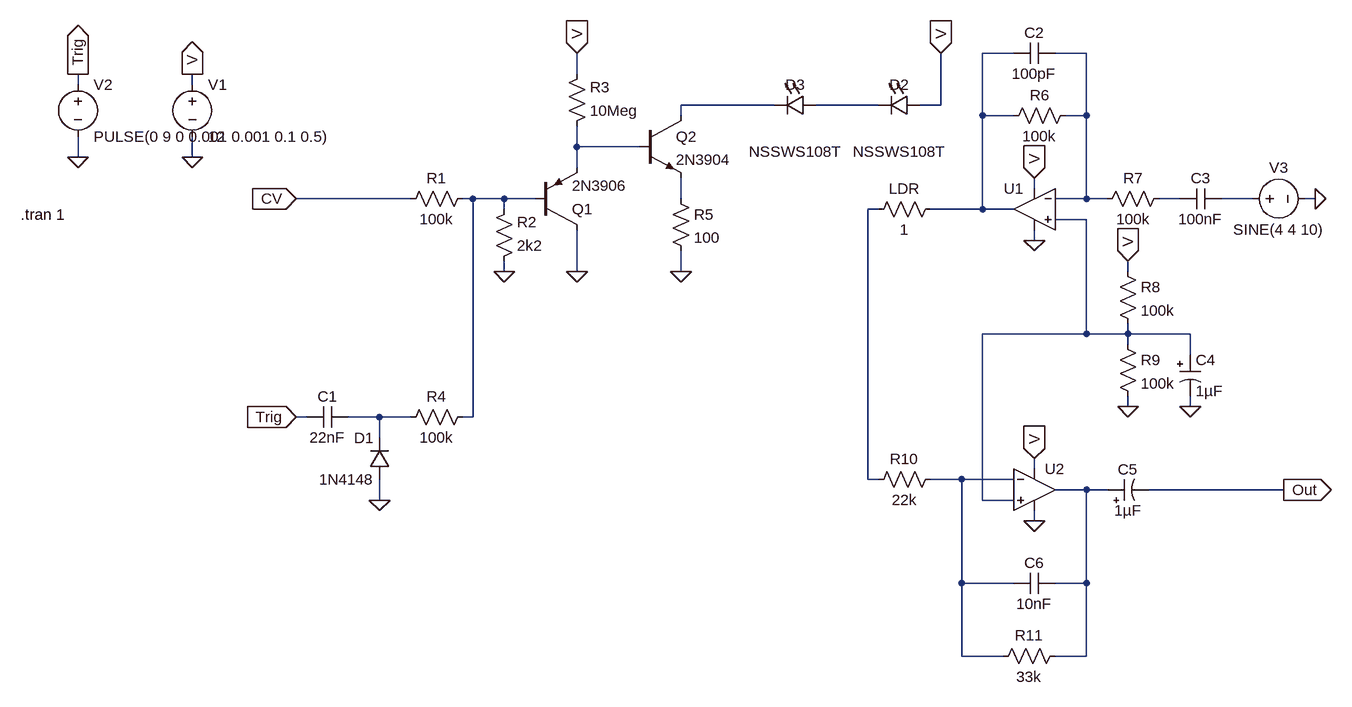
[diagram p0: schematic LPG_VCA.asc]
LPG_VCA.asc, the LTspice schematic file:
Version 4
SHEET 1 1352 824
WIRE 800 -144 752 -144
WIRE 912 -144 864 -144
WIRE 128 -112 128 -144
WIRE -640 -96 -640 -112
WIRE -464 -96 -464 -112
WIRE 432 -64 288 -64
WIRE 592 -64 496 -64
WIRE 688 -64 688 -144
WIRE 688 -64 656 -64
WIRE 288 -48 288 -64
WIRE 752 -48 752 -144
WIRE 800 -48 752 -48
WIRE 912 -48 912 -144
WIRE 912 -48 880 -48
WIRE 128 0 128 -32
WIRE 224 0 128 0
WIRE -640 16 -640 -16
WIRE -464 16 -464 -16
WIRE 128 32 128 0
WIRE 832 64 832 48
WIRE -128 80 -304 80
WIRE -32 80 -48 80
WIRE 16 80 -32 80
WIRE 64 80 16 80
WIRE 288 80 288 48
WIRE 912 80 912 -48
WIRE 912 80 864 80
WIRE 944 80 912 80
WIRE 1056 80 1024 80
WIRE 1168 80 1120 80
WIRE 1264 80 1248 80
WIRE 16 96 16 80
WIRE 592 96 576 96
WIRE 752 96 752 -48
WIRE 752 96 672 96
WIRE 800 96 752 96
WIRE 912 112 864 112
WIRE 832 144 832 128
WIRE 16 192 16 176
WIRE 128 192 128 128
WIRE 288 192 288 160
WIRE 976 192 976 176
WIRE 912 288 912 112
WIRE 912 288 752 288
WIRE 976 288 976 272
WIRE 976 288 912 288
WIRE 1072 288 976 288
WIRE 976 304 976 288
WIRE 1072 320 1072 288
WIRE 976 400 976 384
WIRE 1072 400 1072 384
WIRE -288 416 -304 416
WIRE -176 416 -224 416
WIRE -128 416 -176 416
WIRE -32 416 -32 80
WIRE -32 416 -48 416
WIRE -176 448 -176 416
WIRE 832 496 832 480
WIRE 576 512 576 96
WIRE 592 512 576 512
WIRE 720 512 672 512
WIRE 800 512 720 512
WIRE 912 528 864 528
WIRE 944 528 912 528
WIRE 1216 528 1008 528
WIRE -176 544 -176 512
WIRE 752 544 752 288
WIRE 800 544 752 544
WIRE 832 576 832 560
WIRE 720 672 720 512
WIRE 800 672 720 672
WIRE 912 672 912 528
WIRE 912 672 864 672
WIRE 720 784 720 672
WIRE 784 784 720 784
WIRE 912 784 912 672
WIRE 912 784 864 784
FLAG 288 192 0
FLAG 128 192 0
FLAG 16 192 0
FLAG -464 16 0
FLAG -464 -112 V
IOPIN -464 -112 Out
FLAG 128 -144 V
IOPIN 128 -144 In
FLAG -304 80 CV
IOPIN -304 80 In
FLAG -176 544 0
FLAG -304 416 Trig
IOPIN -304 416 In
FLAG -640 16 0
FLAG -640 -112 Trig
IOPIN -640 -112 Out
FLAG 688 -144 V
IOPIN 688 -144 In
FLAG 832 144 0
FLAG 832 48 V
IOPIN 832 48 In
FLAG 1264 80 0
FLAG 976 176 V
IOPIN 976 176 In
FLAG 976 400 0
FLAG 1072 400 0
FLAG 832 576 0
FLAG 832 480 V
IOPIN 832 480 In
FLAG 1216 528 Out
IOPIN 1216 528 Out
SYMBOL res -32 64 R90
WINDOW 0 0 56 VBottom 2
WINDOW 3 32 56 VTop 2
SYMATTR InstName R1
SYMATTR Value 100k
SYMBOL res 0 192 M180
WINDOW 0 36 76 Left 2
WINDOW 3 36 40 Left 2
SYMATTR InstName R2
SYMATTR Value 2k2
SYMBOL pnp 64 128 M180
SYMATTR InstName Q1
SYMATTR Value 2N3906
SYMBOL npn 224 -48 R0
SYMATTR InstName Q2
SYMATTR Value 2N3904
SYMBOL res 112 -16 M180
WINDOW 0 36 76 Left 2
WINDOW 3 36 40 Left 2
SYMATTR InstName R3
SYMATTR Value 10Meg
SYMBOL voltage -464 -112 R0
SYMATTR InstName V1
SYMATTR Value 12
SYMBOL cap -224 400 R90
WINDOW 0 0 32 VBottom 2
WINDOW 3 32 32 VTop 2
SYMATTR InstName C1
SYMATTR Value 22nF
SYMBOL diode -160 512 R180
WINDOW 0 24 64 Left 2
WINDOW 3 24 0 Left 2
SYMATTR InstName D1
SYMATTR Value 1N4148
SYMBOL res -32 400 R90
WINDOW 0 0 56 VBottom 2
WINDOW 3 32 56 VTop 2
SYMATTR InstName R4
SYMATTR Value 100k
SYMBOL voltage -640 -112 R0
SYMATTR InstName V2
SYMATTR Value PULSE(0 9 0 0.001 0.001 0.1 0.5)
SYMBOL LED 656 -80 R90
WINDOW 0 0 32 VBottom 2
WINDOW 3 72 32 VTop 2
SYMATTR InstName D2
SYMATTR Value NSSWS108T
SYMBOL res 272 64 R0
SYMATTR InstName R5
SYMATTR Value 100
SYMBOL LED 496 -80 R90
WINDOW 0 0 32 VBottom 2
WINDOW 3 72 32 VTop 2
SYMATTR InstName D3
SYMATTR Value NSSWS108T
SYMBOL res 688 80 R90
WINDOW 0 0 56 VBottom 2
WINDOW 3 32 56 VTop 2
SYMATTR InstName LDR
SYMATTR Value 1
SYMBOL Opamps/UniversalOpamp2 832 96 M0
SYMATTR InstName U1
SYMBOL res 896 -64 R90
WINDOW 0 0 56 VBottom 2
WINDOW 3 32 56 VTop 2
SYMATTR InstName R6
SYMATTR Value 100k
SYMBOL cap 864 -160 R90
WINDOW 0 0 32 VBottom 2
WINDOW 3 32 32 VTop 2
SYMATTR InstName C2
SYMATTR Value 100pF
SYMBOL res 1040 64 R90
WINDOW 0 0 56 VBottom 2
WINDOW 3 32 56 VTop 2
SYMATTR InstName R7
SYMATTR Value 100k
SYMBOL cap 1120 64 R90
WINDOW 0 0 32 VBottom 2
WINDOW 3 32 32 VTop 2
SYMATTR InstName C3
SYMATTR Value 100nF
SYMBOL voltage 1152 80 R270
WINDOW 0 32 56 VTop 2
WINDOW 3 -32 56 VBottom 2
SYMATTR InstName V3
SYMATTR Value SINE(4 4 10)
SYMBOL res 960 176 R0
SYMATTR InstName R8
SYMATTR Value 100k
SYMBOL res 960 288 R0
SYMATTR InstName R9
SYMATTR Value 100k
SYMBOL polcap 1056 320 R0
SYMATTR InstName C4
SYMATTR Value 1µF
SYMBOL Opamps/UniversalOpamp2 832 528 R0
SYMATTR InstName U2
SYMBOL polcap 944 544 R270
WINDOW 0 32 32 VTop 2
WINDOW 3 0 32 VBottom 2
SYMATTR InstName C5
SYMATTR Value 1µF
SYMBOL res 688 496 R90
WINDOW 0 0 56 VBottom 2
WINDOW 3 32 56 VTop 2
SYMATTR InstName R10
SYMATTR Value 22k
SYMBOL cap 864 656 R90
WINDOW 0 0 32 VBottom 2
WINDOW 3 32 32 VTop 2
SYMATTR InstName C6
SYMATTR Value 10nF
SYMBOL res 880 768 R90
WINDOW 0 0 56 VBottom 2
WINDOW 3 32 56 VTop 2
SYMATTR InstName R11
SYMATTR Value 33k
TEXT -728 104 Left 2 !.tran 1

The netlist it stands for:
* LPG_VCA.asc
R1 N006 CV 100k
R2 0 N006 2k2
Q1 0 N006 N005 0 2N3906
Q2 N003 N005 N007 0 2N3904
R3 N005 V 10Meg
V1 V 0 12
C1 N012 Trig 22nF
D1 0 N012 1N4148
R4 N006 N012 100k
V2 Trig 0 PULSE(0 9 0 0.001 0.001 0.1 0.5)
D2 V N004 NSSWS108T
R5 N007 0 100
D3 N004 N003 NSSWS108T
R§LDR N001 N010 1
XU1 N011 N002 V 0 N001 level.2 Avol=1Meg GBW=10Meg Slew=10Meg ilimit=25m rail=0 Vos=0 phimargin=45 en=0 enk=0 in=0 ink=0 Rin=500Meg  ; pins IN+ IN- V+ V- OUT
R6 N002 N001 100k
C2 N002 N001 100pF
R7 N008 N002 100k
C3 N009 N008 100nF
V3 N009 0 SINE(4 4 10)
R8 V N011 100k
R9 N011 0 100k
C4 N011 0 1µF
XU2 N011 N013 V 0 N014 level.2 Avol=1Meg GBW=10Meg Slew=10Meg ilimit=25m rail=0 Vos=0 phimargin=45 en=0 enk=0 in=0 ink=0 Rin=500Meg  ; pins IN+ IN- V+ V- OUT
C5 N014 Out 1µF
R10 N013 N010 22k
C6 N014 N013 10nF
R11 N014 N013 33k
.model D D
.lib standard.dio
.model NPN NPN
.model PNP PNP
.lib standard.bjt
.tran 1
.lib UniversalOpamps2.sub
.backanno
.end